# Altium project Hidro-Extra_v2.0.PrjPCB
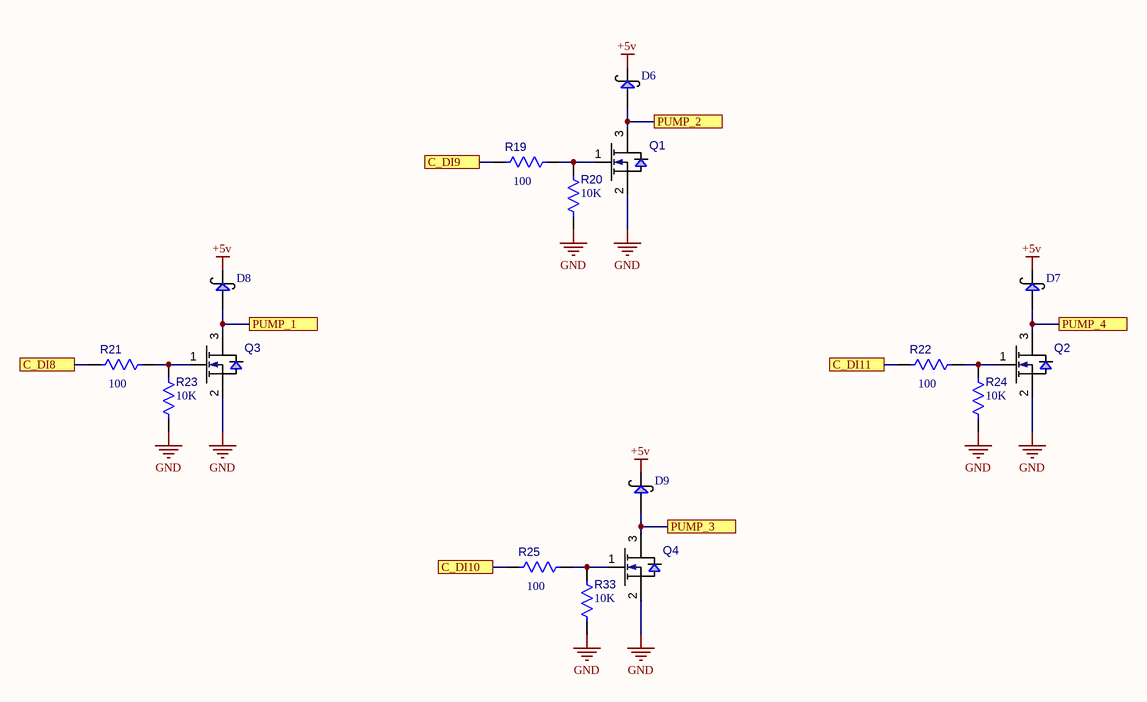
[diagram p0: pump.SchDoc]
3 sheets, 78 parts. Net scope: flat (ports and power ports of the same name join across sheets).
Board file: PCB_HidroExtra_v1.0.PcbDoc
Sheets:
  pump.SchDoc
  adc.SchDoc
  connectors.SchDoc

## Sheet pump.SchDoc
size A4

### Parts
D6  (no value)  [SOD123]
D7  (no value)  [SOD123]
D8  (no value)  [SOD123]
D9  (no value)  [SOD123]
Q1  BSS138  [SOT23_N_123]  (value not drawn)
Q2  BSS138  [SOT23_N_123]  (value not drawn)
Q3  BSS138  [SOT23_N_123]  (value not drawn)
Q4  BSS138  [SOT23_N_123]  (value not drawn)
R19  100  [0805]
R20  10K  [0805]
R21  100  [0805]
R22  100  [0805]
R23  10K  [0805]
R24  10K  [0805]
R25  100  [0805]
R33  10K  [0805]

### Ports
C_DI8, C_DI9, C_DI10, C_DI11, PUMP_1, PUMP_2, PUMP_3, PUMP_4

### Nets
+5v: D6.2 D7.2 D8.2 D9.2
GND: Q1.2 Q2.2 Q3.2 Q4.2 R20.1 R23.1 R24.1 R33.1
NetD6_1: D6.1 Q1.3 ; port PUMP_2
NetD7_1: D7.1 Q2.3 ; port PUMP_4
NetD8_1: D8.1 Q3.3 ; port PUMP_1
NetD9_1: D9.1 Q4.3 ; port PUMP_3
NetJ6_2: R22.1 ; port C_DI11
NetJ6_3: R25.1 ; port C_DI10
NetJ6_4: R19.1 ; port C_DI9
NetJ6_5: R21.1 ; port C_DI8
NetQ1_1: Q1.1 R19.2 R20.2
NetQ2_1: Q2.1 R22.2 R24.2
NetQ3_1: Q3.1 R21.2 R23.2
NetQ4_1: Q4.1 R25.2 R33.2

### Library data of the parts
D6-D9 = MBRX160: SOD123
Q1-Q4 = BSS138: N-Channel MOSFET; Manufacturer: Fairchild; Voltage-Rated: 50V; Value: 6 Ohm Rdson; Package: SOT23
R19-R25 R33 = Res: Resistor; Tolerance: 1%; Package: 0603
  R19 R21 R22 R25: Value: 100
  R20 R23 R24 R33: Value: 10K

## Sheet adc.SchDoc
size A4
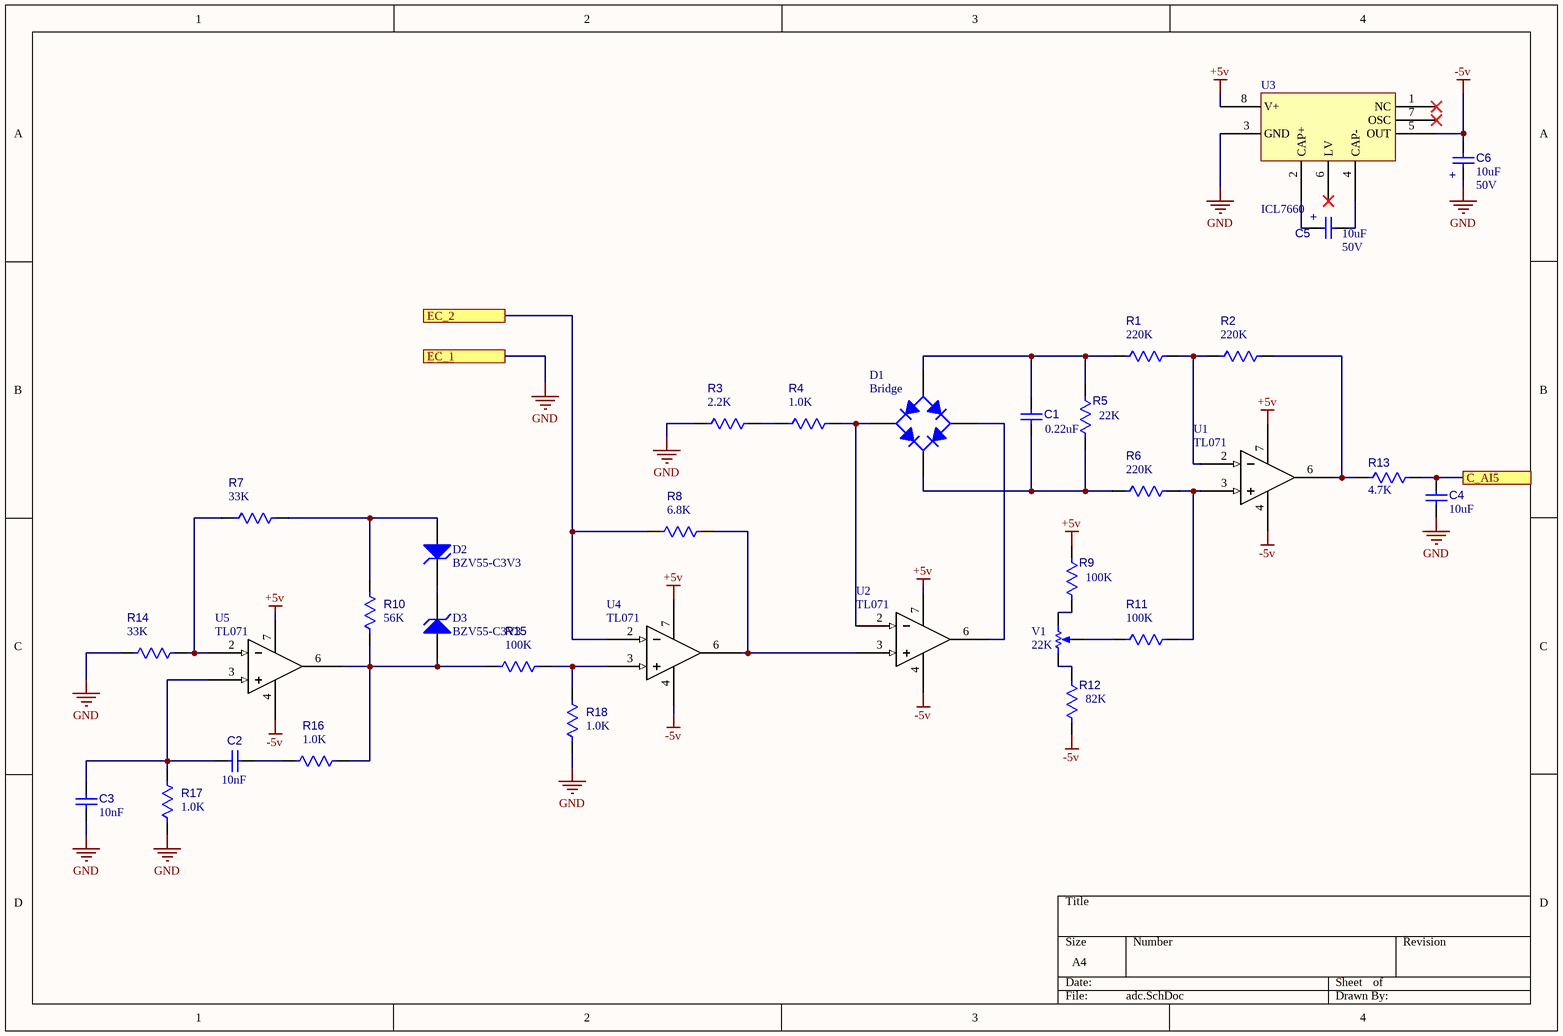
[diagram p1: adc.SchDoc]

### Parts
C1  0.22uF  [0805]
C2  10nF  [0805]
C3  value 10nF  [0805]  (hidden comment: Cap)
C4  value 10uF  [CAPC3216x130N]  (hidden comment: Cap)
C5  Voltage-Rated: 50V  [CAPC3216x130N]  (hidden comment: 10uF)
C6  Voltage-Rated: 50V  [CAPC3216x130N]  (hidden comment: 10uF)
D1  Bridge  [BRIDGE_TO-269AA]
D2  BZV55-C3V3  [SOD80C]
D3  BZV55-C3V3  [SOD80C]
R1  220K  [0805]
R2  220K  [0805]
R3  2.2K  [0805]
R4  1.0K  [0805]
R5  22K  [0805]
R6  220K  [0805]
R7  33K  [0805]
R8  6.8K  [0603]
R9  100K  [0805]
R10  56K  [0603]
R11  100K  [0805]
R12  82K  [0603]
R13  4.7K  [0805]
R14  33K  [0805]
R15  100K  [0805]
R16  1.0K  [0805]
R17  1.0K  [0805]
R18  1.0K  [0805]
U1  TL071  [SO8_L]
U2  TL071  [SO8_L]
U3  ICL7660  [SO8_N]
U4  TL071  [SO8_L]
U5  TL071  [SO8_L]
V1  22K  [HDR1X3]

### Ports
C_AI5, EC_1, EC_2

### Nets
+5v: R9.2 U1.7(+Vcc) U2.7(+Vcc) U3.8(V+) U4.7(+Vcc) U5.7(+Vcc)
-5v: C6.2 R12.1 U1.4(-Vcc) U2.4(-Vcc) U3.5(OUT) U4.4(-Vcc) U5.4(-Vcc)
GND: C3.2 C4.2 C6.1 R3.1 R14.1 R17.2 R18.2 U3.3(GND) ; port EC_1
NetC1_1: C1.1 D1.3(A) R1.1 R5.2
NetC1_2: C1.2 D1.1(K) R5.1 R6.1
NetC2_1: C2.1 C3.1 R17.1 U5.3(+)
NetC2_2: C2.2 R16.1
NetC4_1: C4.1 R13.1 ; port C_AI5
NetC5_1: C5.1 U3.2(CAP+)
NetC5_2: C5.2 U3.4(CAP-)
NetD1_2: D1.2(C) R4.2 U2.2(-)
NetD1_4: D1.4(C) U2.6(output)
NetD2_1: D2.1(A) R7.2 R10.1
NetD2_2: D2.2(K) D3.2(K)
NetD3_1: D3.1(A) R10.2 R15.1 R16.2 U5.6(output)
NetJ17_1: R8.1 U4.2(-) ; port EC_2
NetR1_2: R1.2 R2.1 U1.2(-)
NetR2_2: R2.2 R13.2 U1.6(output)
NetR3_2: R3.2 R4.1
NetR6_2: R6.2 R11.2 U1.3(+)
NetR7_1: R7.1 R14.2 U5.2(-)
NetR8_2: R8.2 U2.3(+) U4.6(output)
NetR9_1: R9.1 V1.3(BOT)
NetR11_1: R11.1 V1.2(TAP)
NetR12_2: R12.2 V1.1(TOP)
NetR15_2: R15.2 R18.1 U4.3(+)

Not connected (* = marked no-connect by the designer): U3 1(NC)* 6(LV)* 7(OSC)*

### Notes on the sheet
- (in symbol Cap Pol) +

### Library data of the parts
C1-C4 = Cap: Tolerance: ±10%; Voltage-Rated: 50V
  C1: Package: 0603; Value: 0.22uF
  C2: Package: 0805; Value: 10nF
  C3: Package: 0805
  C4: Package: 0603
C5 C6 = Cap Pol: Cap; Manufacturer: Panasonic; MfgPartNum: EEE-FC1H220P; Tolerance: ±10%; 3rdMfgr: Vishay / MAL214097103E3; Current: 90 mARMS; Package: 8mm dia.; Value: 10uF
D1 = Bridge: Full Wave Diode Bridge; Published: 8-Jun-2000; LatestRevisionDate: 29-May-2009; LatestRevisionNote: Sch pins A & K swapped.; DatasheetVersion: E2732B; PackageReference: D-38; Publisher: Altium Limited; PackageDescription: Bridge Rectifier; 4 Terminals; Body 9.4 x 9.4 mm (typ); Pitch 5.08 mm
D2 D3 = D Zener: Zener Diode 3.3v - SMD; Published: 8-Jun-2000; LatestRevisionDate: 17-Jul-2002; LatestRevisionNote: Re-released for DXP Platform.; PackageReference: DIODE-0.7; Publisher: Altium Limited; PackageDescription: Diode, Thru-Hole; 2 Leads; 0.7 in Pin Spacing
R1-R18 = Res: Resistor; Tolerance: 1%; Package: 0603
  R1 R2 R6: Value: 220K
  R3: Value: 2.2K
  R4 R16-R18: Value: 1.0K
  R5: Value: 22K
  R7 R14: Value: 33K
  R8: Value: 6.8K
  R9 R11 R15: Value: 100K
  R10: Value: 56K
  R12: Value: 82K
  R13: Value: 4.7K
U1 U2 U4 U5 = TL071: Low-noise jfet-input operational amplifiers
U3 = ICL7660: CMOS Voltage Converters, from positive to negative for an input range of +1.5V to +10.0V
V1 = Preset: Potentiometer; Sim Note: Enter the Resistance value and the set point into parameter fields.; Set Position: 0.5; Published: 8-Jun-2000; LatestRevisionDate: 17-Jul-2002; LatestRevisionNote: Re-released for DXP Platform.; PackageReference: VR5; Publisher: Altium Limited; PackageDescription: Variable Resistor, Thru-Hole; 3 Leads; Value: 22K

## Sheet connectors.SchDoc
size A4
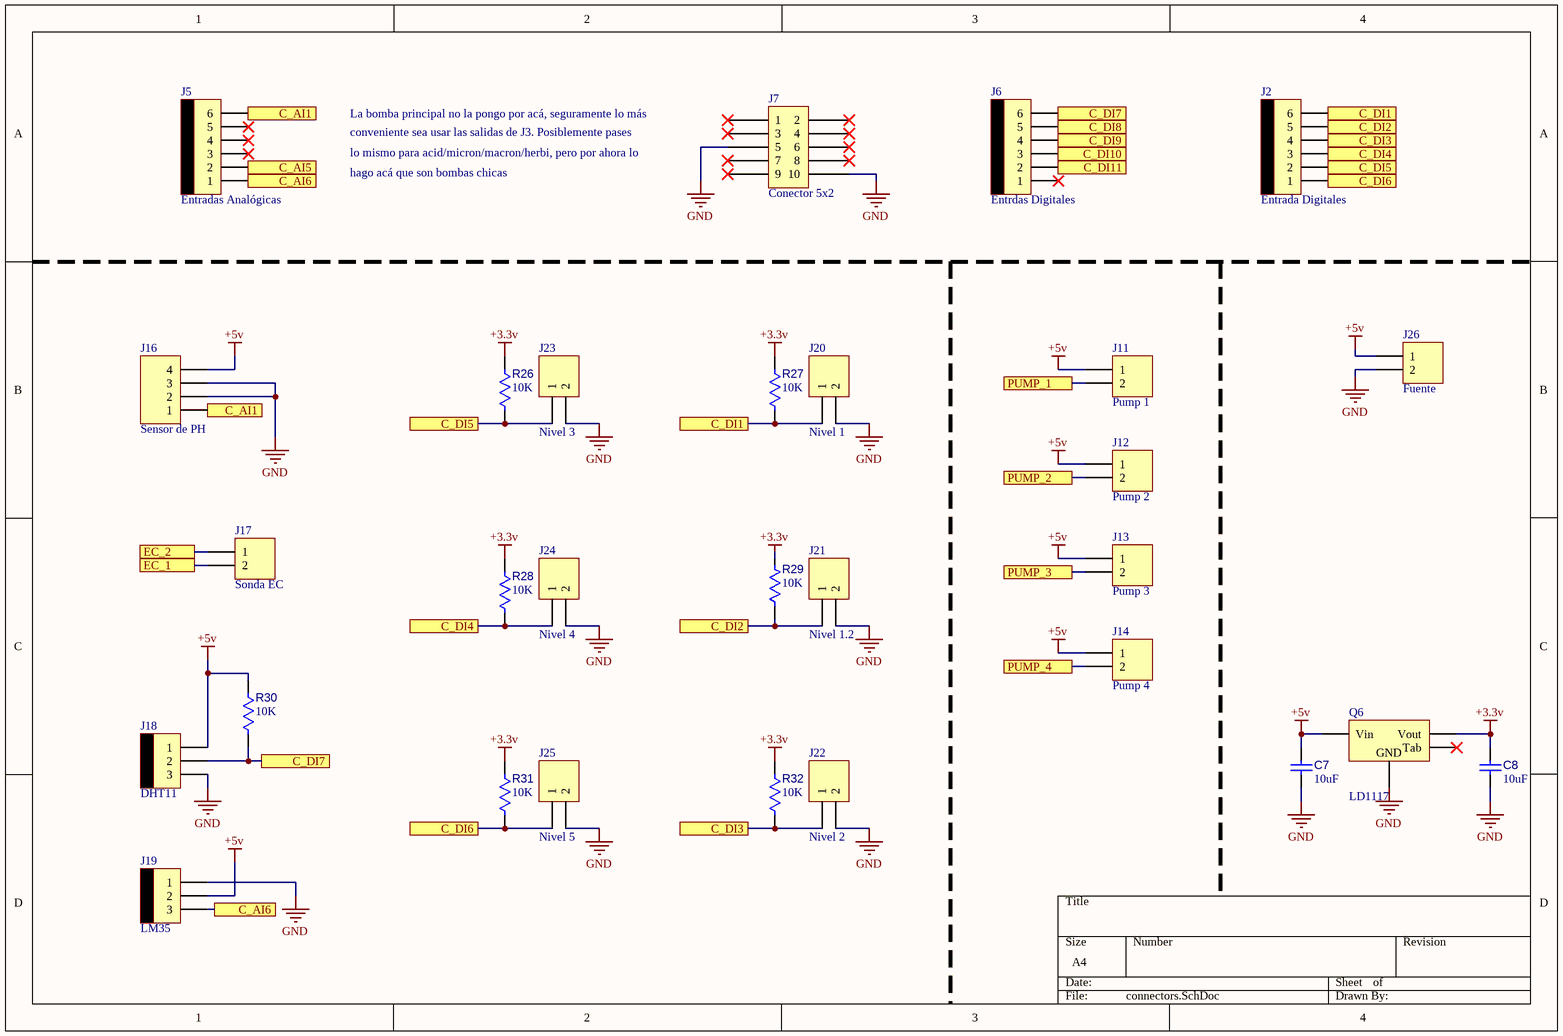
[diagram p2: connectors.SchDoc]

### Parts
C7  10uF  [CAPC3216x130N]
C8  10uF  [CAPC3216x130N]
J2  Entrada Digitales  [MOLEX6]
J5  Entradas Analógicas  [MOLEX6]
J6  Entrdas Digitales  [MOLEX6]
J7  Conector 5x2  [CONN_5x2_BOX]
J11  Pump 1  [MOLEX2]
J12  Pump 2  [MOLEX2]
J13  Pump 3  [MOLEX2]
J14  Pump 4  [MOLEX2]
J16  Sensor de PH  [HDR1X4]
J17  Sonda EC  [HDR1X2H]
J18  DHT11  [MOLEX3]
J19  LM35  [MOLEX3]
J20  Nivel 1  [MOLEX2]
J21  Nivel 1.2  [MOLEX2]
J22  Nivel 2  [MOLEX2]
J23  Nivel 3  [MOLEX2]
J24  Nivel 4  [MOLEX2]
J25  Nivel 5  [MOLEX2]
J26  Fuente  [CON_2_156]
Q6  LD1117  [SOT223_N]
R26  10K  [0805]
R27  10K  [0805]
R28  10K  [0805]
R29  10K  [0805]
R30  10K  [0805]
R31  10K  [0805]
R32  10K  [0805]

### Ports
C_AI1, C_AI5, C_AI6, C_DI1, C_DI2, C_DI3, C_DI4, C_DI5, C_DI6, C_DI7, C_DI8, C_DI9, C_DI10, C_DI11, EC_1, EC_2, PUMP_1, PUMP_2, PUMP_3, PUMP_4

### Nets
+3.3v: C8.2 Q6.2(Vout) R26.2 R27.2 R28.2 R29.2 R31.2 R32.2
+5v: C7.1 J11.1 J12.1 J13.1 J14.1 J16.4 J18.1 J19.2 J26.1 Q6.3(Vin) R30.2
GND: C7.2 C8.1 J7.5 J7.10 J16.2 J16.3 J17.2 J18.3 J19.1 J20.2 J21.2 J22.2 J23.2 J24.2 J25.2 J26.2 Q6.1(GND) ; port EC_1
NetC4_1: J5.2 ; port C_AI5
NetD6_1: J12.2 ; port PUMP_2
NetD7_1: J14.2 ; port PUMP_4
NetD8_1: J11.2 ; port PUMP_1
NetD9_1: J13.2 ; port PUMP_3
NetJ2_1: J2.1 J25.1 R31.1 ; port C_DI6
NetJ2_2: J2.2 J23.1 R26.1 ; port C_DI5
NetJ2_3: J2.3 J24.1 R28.1 ; port C_DI4
NetJ2_4: J2.4 J22.1 R32.1 ; port C_DI3
NetJ2_5: J2.5 J21.1 R29.1 ; port C_DI2
NetJ2_6: J2.6 J20.1 R27.1 ; port C_DI1
NetJ5_1: J5.1 J19.3 ; port C_AI6
NetJ5_6: J5.6 J16.1 ; port C_AI1
NetJ6_2: J6.2 ; port C_DI11
NetJ6_3: J6.3 ; port C_DI10
NetJ6_4: J6.4 ; port C_DI9
NetJ6_5: J6.5 ; port C_DI8
NetJ6_6: J6.6 J18.2 R30.1 ; port C_DI7
NetJ17_1: J17.1 ; port EC_2

Not connected (* = marked no-connect by the designer): J5 3* 4* 5*; J6 1*; J7 1* 2* 3* 4* 6* 7* 8* 9*; Q6 4(Tab)*

### Notes on the sheet
- La bomba principal no la pongo por acá, seguramente lo más
- conveniente sea usar las salidas de J3. Posiblemente pases
- lo mismo para acid/micron/macron/herbi, pero por ahora lo
- hago acá que son bombas chicas

### Library data of the parts
C7 C8 = Cap: Tolerance: ±10%; Voltage-Rated: 6.3V; Package: 0603; Value: 10uF
J2 J5 J6 = MOLEX6
J11-J14 J20-J26 = Header 2: Header, 2-Pin; LatestRevisionDate: 17-Jul-2002; LatestRevisionNote: Re-released for DXP Platform.; Publisher: Altium Limited
J16 = Header 4: LatestRevisionDate: 17-Jul-2002; LatestRevisionNote: Re-released for DXP Platform.; Publisher: Altium Limited
J17 = Header 2H: Header, 2-Pin, Right Angle; LatestRevisionDate: 17-Jul-2002; LatestRevisionNote: Re-released for DXP Platform.; Publisher: Altium Limited
J18 J19 = MOLEX3
Q6 = LD1117: Voltage Reg., Low Drop; PackageReference: SOT-223; PackageDescription: 3-Pin Transistor Outline Package 2.54 mm Pitch, 15.1 mm Lead Span
R26-R32 = Res: Resistor; Tolerance: 1%; Package: 0603; Value: 10K

## Nets that join several sheets
+5v: pump (D6.2 D7.2 D8.2 D9.2), adc (6 pins), connectors (11 pins)
GND: pump (8 pins), adc (8 pins), connectors (17 pins)
NetC4_1: adc (C4.1 R13.1), connectors (J5.2)
NetD6_1: pump (D6.1 Q1.3), connectors (J12.2)
NetD7_1: pump (D7.1 Q2.3), connectors (J14.2)
NetD8_1: pump (D8.1 Q3.3), connectors (J11.2)
NetD9_1: pump (D9.1 Q4.3), connectors (J13.2)
NetJ6_2: pump (R22.1), connectors (J6.2)
NetJ6_3: pump (R25.1), connectors (J6.3)
NetJ6_4: pump (R19.1), connectors (J6.4)
NetJ6_5: pump (R21.1), connectors (J6.5)
NetJ17_1: adc (R8.1 U4.2), connectors (J17.1)